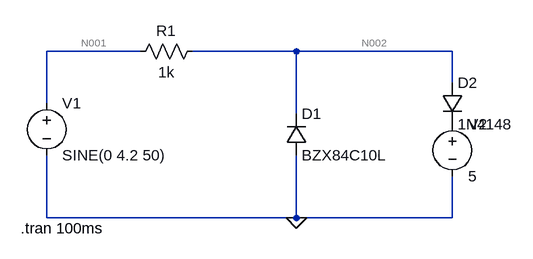
[diagram p0: schematic IE_Tut1.asc]
IE_Tut1.asc, the LTspice schematic file:
Version 4.1
SHEET 1 880 680
WIRE 256 64 112 64
WIRE 496 64 336 64
WIRE 736 64 496 64
WIRE 736 112 736 64
WIRE 112 144 112 64
WIRE 496 160 496 64
WIRE 112 320 112 224
WIRE 496 320 496 224
WIRE 496 320 112 320
WIRE 736 320 736 256
WIRE 736 320 496 320
FLAG 496 320 0
SYMBOL voltage 112 128 R0
WINDOW 123 0 0 Left 0
WINDOW 39 0 0 Left 0
SYMATTR InstName V1
SYMATTR Value SINE(0 4.2 50)
SYMBOL res 352 48 R90
WINDOW 0 0 56 VBottom 2
WINDOW 3 32 56 VTop 2
SYMATTR InstName R1
SYMATTR Value 1k
SYMBOL diode 480 224 M180
WINDOW 0 24 64 Left 2
WINDOW 3 24 0 Left 2
SYMATTR InstName D1
SYMATTR Value BZX84C10L
SYMATTR Description Diode
SYMATTR Type diode
SYMBOL diode 720 112 R0
SYMATTR InstName D2
SYMATTR Value 1N4148
SYMBOL voltage 736 160 R0
WINDOW 123 0 0 Left 0
WINDOW 39 0 0 Left 0
SYMATTR InstName V2
SYMATTR Value 5
TEXT 72 336 Left 2 !.tran 100ms

The netlist it stands for:
* IE_Tut1.asc
V1 N001 0 SINE(0 4.2 50)
R1 N002 N001 1k
D1 0 N002 BZX84C10L
D2 N002 P001 1N4148
V2 P001 0 5
.model D D
.lib standard.dio
.tran 100ms
.backanno
.end

* Results of the author's LTspice run, read from the files saved beside the schematic
* Operating Point, zero values left out:
*   V(n002) = 2.525 µV
*   V(p001) = 5 V
*   I(V1) = 2.525 nA
*   I(V2) = -2.525 nA
*   I(R1) = 2.525 nA
*   I(D2) = -2.525 nA
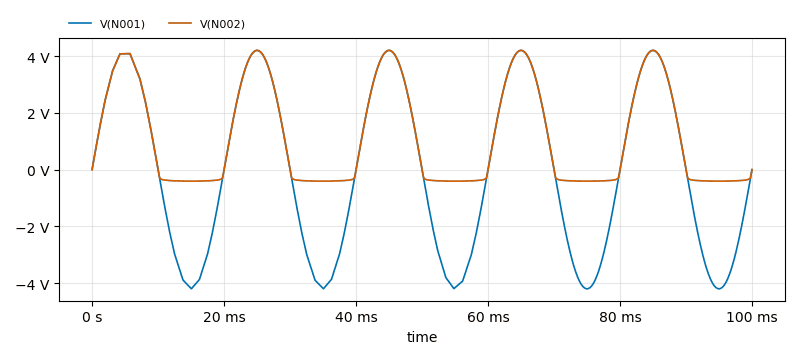
[diagram p1: Transient Analysis of IE_Tut1.asc, plotted from the saved traces]
* Transient Analysis, 1 run:
*   V(N001): min -4.2 V, max 4.2 V, average 4.813 mV, rms 2.961 V, last 0 V
*   V(N002): min -406.9 mV, max 4.2 V, average 1.145 V, rms 2.114 V, last -266.7 µV